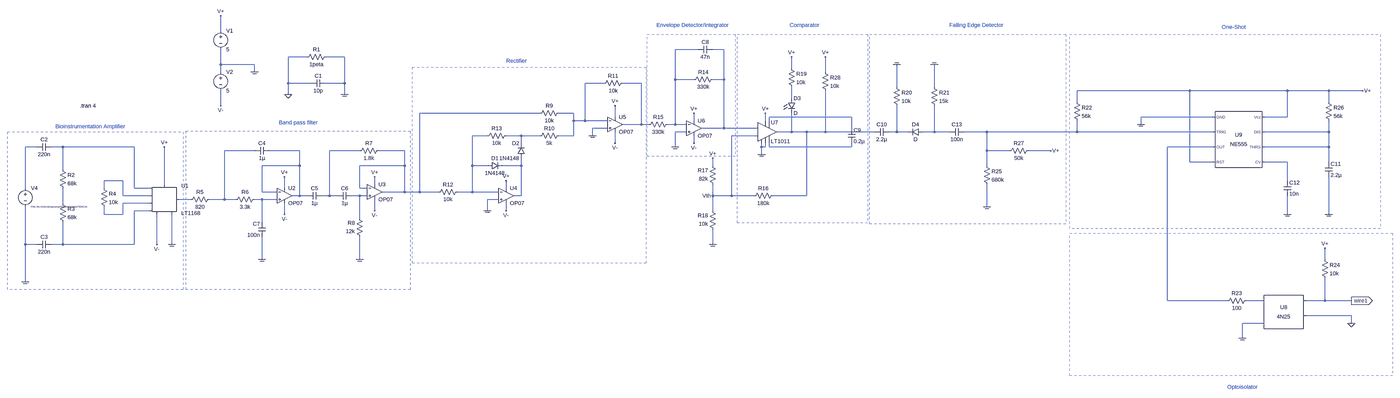
[diagram p0: schematic Full_EMG.asc, whole sheet]
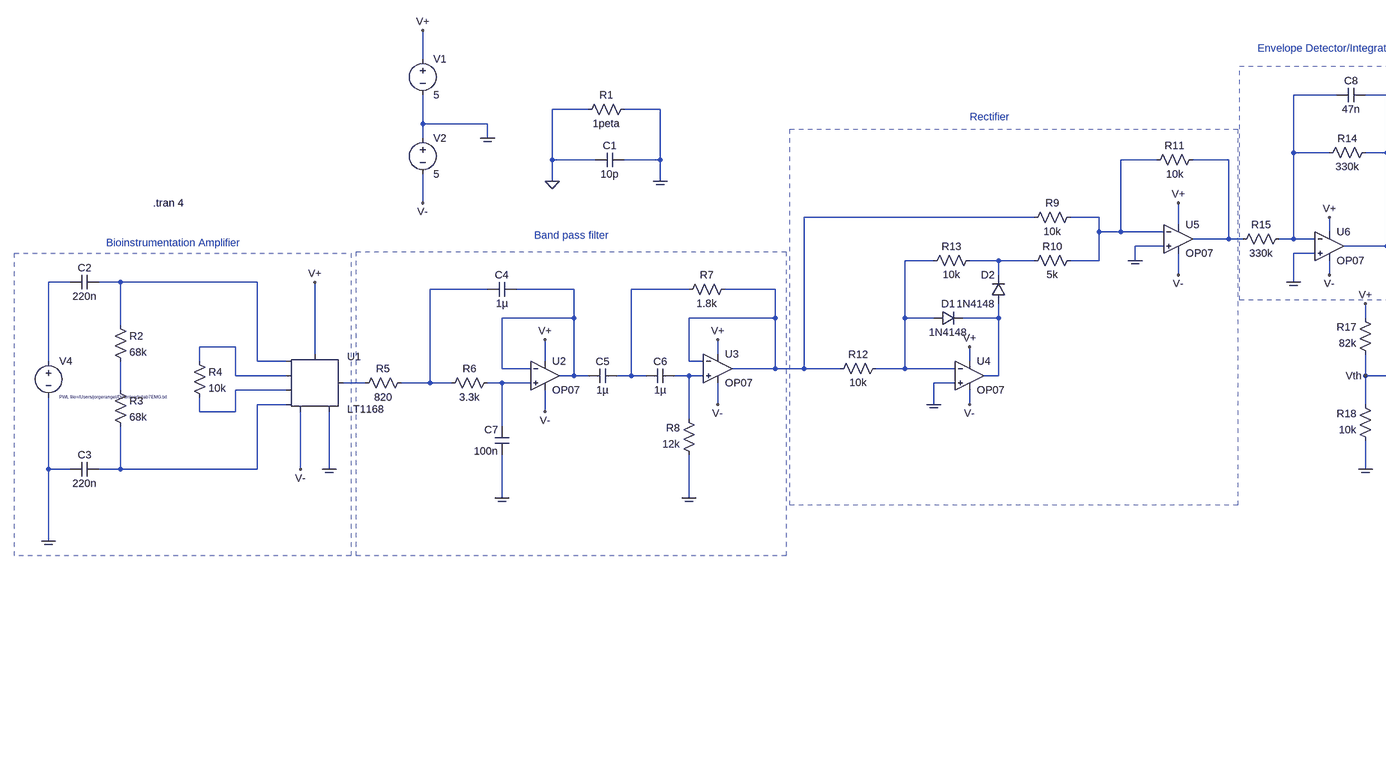
[diagram p1: schematic Full_EMG.asc, part, row 1 of 1, column 1 of 2]
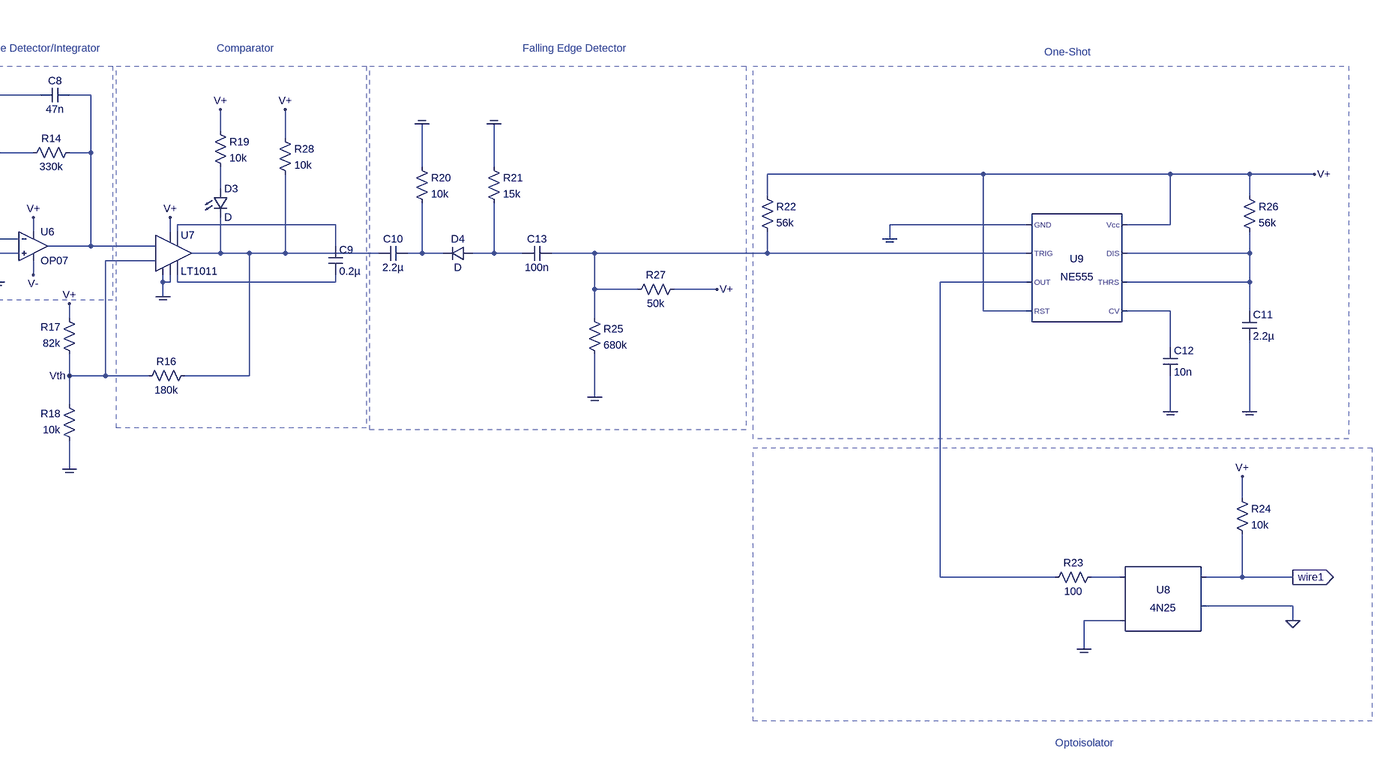
[diagram p2: schematic Full_EMG.asc, part, row 1 of 1, column 2 of 2]
Full_EMG.asc, the LTspice schematic file:
Version 4
SHEET 1 5388 960
WIRE 160 -576 160 -640
WIRE 2192 -496 2096 -496
WIRE 2304 -496 2256 -496
WIRE 528 -464 448 -464
WIRE 688 -464 608 -464
WIRE 160 -432 160 -496
WIRE 304 -432 160 -432
WIRE 2592 -416 2592 -464
WIRE 160 -400 160 -432
WIRE 304 -400 304 -432
WIRE 2736 -400 2736 -464
WIRE 2096 -368 2096 -496
WIRE 2176 -368 2096 -368
WIRE 2304 -368 2304 -496
WIRE 2304 -368 2256 -368
WIRE 448 -352 448 -464
WIRE 544 -352 448 -352
WIRE 688 -352 688 -464
WIRE 688 -352 608 -352
WIRE 1792 -352 1712 -352
WIRE 1952 -352 1872 -352
WIRE 3040 -336 3040 -432
WIRE 3200 -336 3200 -432
WIRE 4288 -320 3808 -320
WIRE 4704 -320 4288 -320
WIRE 4880 -320 4704 -320
WIRE 5024 -320 4880 -320
WIRE 448 -304 448 -352
WIRE 688 -304 688 -352
WIRE 2592 -288 2592 -336
WIRE 3808 -272 3808 -320
WIRE 4880 -272 4880 -320
WIRE 160 -256 160 -320
WIRE 1520 -224 1008 -224
WIRE 1664 -224 1600 -224
WIRE 1840 -208 1840 -256
WIRE 2848 -208 2496 -208
WIRE 4384 -208 4080 -208
WIRE 4704 -208 4704 -320
WIRE 4704 -208 4608 -208
WIRE 1664 -192 1664 -224
WIRE 1712 -192 1712 -352
WIRE 1712 -192 1664 -192
WIRE 1808 -192 1712 -192
WIRE 2176 -192 2176 -224
WIRE 2480 -192 2480 -224
WIRE 2496 -192 2496 -208
WIRE 1952 -176 1952 -352
WIRE 1952 -176 1872 -176
WIRE 1984 -176 1952 -176
WIRE 2096 -176 2096 -368
WIRE 2096 -176 2064 -176
WIRE 2144 -176 2096 -176
WIRE 4080 -176 4080 -208
WIRE 1808 -160 1744 -160
WIRE 2304 -160 2304 -368
WIRE 2304 -160 2208 -160
WIRE 2448 -160 2304 -160
WIRE 2848 -160 2848 -208
WIRE 2144 -144 2096 -144
WIRE 2592 -144 2592 -224
WIRE 2592 -144 2528 -144
WIRE 2656 -144 2592 -144
WIRE 2736 -144 2736 -320
WIRE 2736 -144 2656 -144
WIRE 2944 -144 2736 -144
WIRE 3040 -144 3040 -256
WIRE 3040 -144 3008 -144
WIRE 3088 -144 3040 -144
WIRE 3200 -144 3200 -256
WIRE 3200 -144 3152 -144
WIRE 3264 -144 3200 -144
WIRE 3424 -144 3328 -144
WIRE 3808 -144 3808 -192
WIRE 3808 -144 3424 -144
WIRE 4384 -144 3808 -144
WIRE 4880 -144 4880 -192
WIRE 4880 -144 4608 -144
WIRE 1296 -128 1232 -128
WIRE 1440 -128 1376 -128
WIRE 1520 -128 1440 -128
WIRE 1664 -128 1664 -192
WIRE 1664 -128 1600 -128
WIRE 1744 -128 1744 -160
WIRE 2448 -128 2336 -128
WIRE 1440 -96 1440 -128
WIRE 1840 -96 1840 -144
WIRE 2176 -96 2176 -128
WIRE -624 -80 -672 -80
WIRE -512 -80 -560 -80
WIRE -208 -80 -512 -80
WIRE 2096 -80 2096 -144
WIRE 2464 -80 2464 -96
WIRE 2480 -80 2480 -96
WIRE 2480 -80 2464 -80
WIRE 2496 -80 2496 -96
WIRE 2848 -80 2848 -96
WIRE 2848 -80 2496 -80
WIRE 4384 -80 4192 -80
WIRE 4880 -80 4880 -144
WIRE 4880 -80 4608 -80
WIRE 304 -64 176 -64
WIRE 496 -64 368 -64
WIRE 752 -64 624 -64
WIRE 944 -64 832 -64
WIRE 3424 -64 3424 -144
WIRE 3520 -64 3424 -64
WIRE 3696 -64 3600 -64
WIRE 2464 -48 2464 -80
WIRE 4288 -16 4288 -320
WIRE 4384 -16 4288 -16
WIRE 4704 -16 4608 -16
WIRE 4880 -16 4880 -80
WIRE 496 0 496 -64
WIRE 496 0 336 0
WIRE 944 0 944 -64
WIRE 944 0 752 0
WIRE 1232 0 1232 -128
WIRE 1296 0 1232 0
WIRE 1440 0 1440 -32
WIRE 1440 0 1360 0
WIRE 2256 0 2256 -32
WIRE 3424 0 3424 -64
WIRE -512 16 -512 -80
WIRE -256 64 -336 64
WIRE 4704 64 4704 -16
WIRE -80 80 -80 -80
WIRE 816 80 816 48
WIRE -672 96 -672 -80
WIRE -336 96 -336 64
WIRE -208 96 -208 -80
WIRE -144 96 -208 96
WIRE 432 96 432 48
WIRE 752 96 752 0
WIRE 784 96 752 96
WIRE 1376 96 1376 64
WIRE 336 112 336 0
WIRE 400 112 336 112
WIRE 944 112 944 0
WIRE 944 112 848 112
WIRE 1008 112 1008 -224
WIRE 1008 112 944 112
WIRE 1088 112 1008 112
WIRE 1232 112 1232 0
WIRE 1232 112 1168 112
WIRE 1344 112 1232 112
WIRE -256 128 -256 64
WIRE -144 128 -256 128
WIRE 496 128 496 0
WIRE 496 128 464 128
WIRE 528 128 496 128
WIRE 624 128 624 -64
WIRE 624 128 592 128
WIRE 656 128 624 128
WIRE 752 128 720 128
WIRE 784 128 752 128
WIRE 1440 128 1440 0
WIRE 1440 128 1408 128
WIRE 2256 128 2256 80
WIRE 2336 128 2336 -128
WIRE 2336 128 2256 128
WIRE 2432 128 2336 128
WIRE 2656 128 2656 -144
WIRE 2656 128 2512 128
WIRE 32 144 -16 144
WIRE 176 144 176 -64
WIRE 176 144 112 144
WIRE 224 144 176 144
WIRE 336 144 304 144
WIRE 400 144 336 144
WIRE 1344 144 1296 144
WIRE -512 160 -512 96
WIRE -144 160 -256 160
WIRE 3424 176 3424 80
WIRE -144 192 -208 192
WIRE 816 192 816 144
WIRE 1296 192 1296 144
WIRE 1376 192 1376 160
WIRE 2256 192 2256 128
WIRE -336 208 -336 176
WIRE -256 208 -256 160
WIRE -256 208 -336 208
WIRE 432 208 432 160
WIRE 4704 208 4704 128
WIRE 4880 208 4880 48
WIRE 752 224 752 128
WIRE 336 240 336 144
WIRE -672 336 -672 176
WIRE -624 336 -672 336
WIRE -512 336 -512 240
WIRE -512 336 -560 336
WIRE -208 336 -208 192
WIRE -208 336 -512 336
WIRE -112 336 -112 208
WIRE -48 336 -48 208
WIRE 2256 336 2256 272
WIRE 336 400 336 304
WIRE 752 400 752 304
WIRE 4864 400 4864 352
WIRE -672 496 -672 336
WIRE 4192 576 4192 -80
WIRE 4448 576 4192 576
WIRE 4592 576 4528 576
WIRE 4864 576 4864 480
WIRE 4864 576 4784 576
WIRE 4976 576 4864 576
WIRE 4976 640 4784 640
WIRE 4592 672 4512 672
WIRE 4976 672 4976 640
WIRE 4512 736 4512 672
FLAG 304 -400 COM
FLAG 160 -640 V+
FLAG 160 -256 V-
FLAG 448 -304 0
FLAG 688 -304 COM
FLAG -48 336 COM
FLAG -672 496 COM
FLAG -80 -80 V+
FLAG -112 336 V-
FLAG 336 400 COM
FLAG 752 400 COM
FLAG 816 48 V+
FLAG 816 192 V-
FLAG 432 208 V-
FLAG 432 48 V+
FLAG 1840 -256 V+
FLAG 1840 -96 V-
FLAG 1376 192 V-
FLAG 1376 64 V+
FLAG 1296 192 COM
FLAG 1744 -128 COM
FLAG 2176 -224 V+
FLAG 2176 -96 V-
FLAG 2096 -80 COM
FLAG 2256 336 COM
FLAG 2256 -32 V+
FLAG 2464 -48 COM
FLAG 2480 -224 V+
FLAG 2256 128 Vth
FLAG 2592 -464 V+
FLAG 3200 -432 COM
FLAG 3040 -432 COM
FLAG 4976 672 0
FLAG 4512 736 COM
FLAG 4864 352 V+
FLAG 4976 576 wire1
IOPIN 4976 576 Out
FLAG 4704 208 COM
FLAG 4880 208 COM
FLAG 4080 -176 COM
FLAG 5024 -320 V+
FLAG 3424 176 COM
FLAG 3696 -64 V+
FLAG 2736 -464 V+
SYMBOL Voltage 160 -592 R0
SYMATTR InstName V1
SYMATTR Value 5
SYMBOL Voltage 160 -416 R0
SYMATTR InstName V2
SYMATTR Value 5
SYMBOL Res 624 -480 R90
WINDOW 0 0 56 VBottom 2
WINDOW 3 32 56 VTop 2
SYMATTR InstName R1
SYMATTR Value 1peta
SYMBOL Cap 608 -368 R90
WINDOW 0 0 32 VBottom 2
WINDOW 3 32 32 VTop 2
SYMATTR InstName C1
SYMATTR Value 10p
SYMBOL Voltage -672 80 R0
WINDOW 3 24 96 Left 0
SYMATTR Value PWL file=/Users/jorgerangel/Downloads/lab7EMG.txt
SYMATTR InstName V4
SYMBOL Cap -560 -96 R90
WINDOW 0 0 32 VBottom 2
WINDOW 3 32 32 VTop 2
SYMATTR InstName C2
SYMATTR Value 220n
SYMBOL Cap -560 320 R90
WINDOW 0 0 32 VBottom 2
WINDOW 3 32 32 VTop 2
SYMATTR InstName C3
SYMATTR Value 220n
SYMBOL Res -528 0 R0
SYMATTR InstName R2
SYMATTR Value 68k
SYMBOL Res -528 144 R0
SYMATTR InstName R3
SYMATTR Value 68k
SYMBOL Res -352 80 R0
SYMATTR InstName R4
SYMATTR Value 10k
SYMBOL OpAmps/LT1168 -80 144 R0
SYMATTR InstName U1
SYMBOL Res 128 128 R90
WINDOW 0 0 56 VBottom 2
WINDOW 3 32 56 VTop 2
SYMATTR InstName R5
SYMATTR Value 820
SYMBOL Res 320 128 R90
WINDOW 0 0 56 VBottom 2
WINDOW 3 32 56 VTop 2
SYMATTR InstName R6
SYMATTR Value 3.3k
SYMBOL Res 848 -80 R90
WINDOW 0 0 56 VBottom 2
WINDOW 3 32 56 VTop 2
SYMATTR InstName R7
SYMATTR Value 1.8k
SYMBOL Res 768 320 R180
WINDOW 0 36 76 Left 2
WINDOW 3 36 40 Left 2
SYMATTR InstName R8
SYMATTR Value 12k
SYMBOL OpAmps/OP07 432 64 R0
SYMATTR InstName U2
SYMBOL Cap 368 -80 R90
WINDOW 0 0 32 VBottom 2
WINDOW 3 32 32 VTop 2
SYMATTR InstName C4
SYMATTR Value 1µ
SYMBOL Cap 592 112 R90
WINDOW 0 0 32 VBottom 2
WINDOW 3 32 32 VTop 2
SYMATTR InstName C5
SYMATTR Value 1µ
SYMBOL Cap 720 112 R90
WINDOW 0 0 32 VBottom 2
WINDOW 3 32 32 VTop 2
SYMATTR InstName C6
SYMATTR Value 1µ
SYMBOL Cap 352 304 R180
WINDOW 0 24 56 Left 2
WINDOW 3 24 8 Left 2
SYMATTR InstName C7
SYMATTR Value 100n
SYMBOL OpAmps/OP07 816 48 R0
SYMATTR InstName U3
SYMBOL Res 1616 -240 R90
WINDOW 0 0 56 VBottom 2
WINDOW 3 32 56 VTop 2
SYMATTR InstName R9
SYMATTR Value 10k
SYMBOL Res 1616 -144 R90
WINDOW 0 0 56 VBottom 2
WINDOW 3 32 56 VTop 2
SYMATTR InstName R10
SYMATTR Value 5k
SYMBOL Res 1888 -368 R90
WINDOW 0 0 56 VBottom 2
WINDOW 3 32 56 VTop 2
SYMATTR InstName R11
SYMATTR Value 10k
SYMBOL OpAmps/OP07 1376 64 R0
SYMATTR InstName U4
SYMBOL OpAmps/OP07 1840 -240 R0
SYMATTR InstName U5
SYMBOL Res 1184 96 R90
WINDOW 0 0 56 VBottom 2
WINDOW 3 32 56 VTop 2
SYMATTR InstName R12
SYMATTR Value 10k
SYMBOL Diode 1296 16 R270
WINDOW 0 32 32 VTop 2
WINDOW 3 0 32 VBottom 2
SYMATTR InstName D1
SYMATTR Value 1N4148
SYMBOL Diode 1456 -32 R180
WINDOW 0 24 64 Left 2
WINDOW 3 24 0 Left 2
SYMATTR InstName D2
SYMATTR Value 1N4148
SYMBOL Res 1392 -144 R90
WINDOW 0 0 56 VBottom 2
WINDOW 3 32 56 VTop 2
SYMATTR InstName R13
SYMATTR Value 10k
SYMBOL Res 2160 -352 R270
WINDOW 0 32 56 VTop 2
WINDOW 3 0 56 VBottom 2
SYMATTR InstName R14
SYMATTR Value 330k
SYMBOL Cap 2192 -480 R270
WINDOW 0 32 32 VTop 2
WINDOW 3 0 32 VBottom 2
SYMATTR InstName C8
SYMATTR Value 47n
SYMBOL Res 1968 -160 R270
WINDOW 0 32 56 VTop 2
WINDOW 3 0 56 VBottom 2
SYMATTR InstName R15
SYMATTR Value 330k
SYMBOL OpAmps/OP07 2176 -224 R0
SYMATTR InstName U6
SYMBOL Res 2528 112 R90
WINDOW 0 0 56 VBottom 2
WINDOW 3 32 56 VTop 2
SYMATTR InstName R16
SYMATTR Value 180k
SYMBOL Res 2272 96 R180
WINDOW 0 36 76 Left 2
WINDOW 3 36 40 Left 2
SYMATTR InstName R17
SYMATTR Value 82k
SYMBOL Res 2272 288 R180
WINDOW 0 36 76 Left 2
WINDOW 3 36 40 Left 2
SYMATTR InstName R18
SYMATTR Value 10k
SYMBOL Comparators/LT1011 2480 -144 R0
SYMATTR InstName U7
SYMBOL Res 2576 -432 R0
SYMATTR InstName R19
SYMATTR Value 10k
SYMBOL LED 2576 -288 R0
SYMATTR InstName D3
SYMBOL Cap 2832 -160 R0
SYMATTR InstName C9
SYMATTR Value 0.2µ
SYMBOL Diode 3152 -160 R90
WINDOW 0 0 32 VBottom 2
WINDOW 3 32 32 VTop 2
SYMATTR InstName D4
SYMBOL Cap 3008 -160 R90
WINDOW 0 0 32 VBottom 2
WINDOW 3 32 32 VTop 2
SYMATTR InstName C10
SYMATTR Value 2.2µ
SYMBOL Res 3024 -352 R0
SYMATTR InstName R20
SYMATTR Value 10k
SYMBOL Res 3184 -352 R0
SYMATTR InstName R21
SYMATTR Value 15k
SYMBOL Optos/4N25 4688 640 R0
SYMATTR InstName U8
SYMBOL Res 4544 560 R90
WINDOW 0 0 56 VBottom 2
WINDOW 3 32 56 VTop 2
SYMATTR InstName R23
SYMATTR Value 100
SYMBOL Res 4848 384 R0
SYMATTR InstName R24
SYMATTR Value 10k
SYMBOL Misc/NE555 4496 -112 R0
SYMATTR InstName U9
SYMBOL Res 3792 -288 R0
SYMATTR InstName R22
SYMATTR Value 56k
SYMBOL Res 4864 -288 R0
SYMATTR InstName R26
SYMATTR Value 56k
SYMBOL Cap 4864 -16 R0
SYMATTR InstName C11
SYMATTR Value 2.2µ
SYMBOL Cap 4688 64 R0
SYMATTR InstName C12
SYMATTR Value 10n
SYMBOL Cap 3328 -160 R90
WINDOW 0 0 32 VBottom 2
WINDOW 3 32 32 VTop 2
SYMATTR InstName C13
SYMATTR Value 100n
SYMBOL Res 3408 -16 R0
SYMATTR InstName R25
SYMATTR Value 680k
SYMBOL Res 3616 -80 R90
WINDOW 0 0 56 VBottom 2
WINDOW 3 32 56 VTop 2
SYMATTR InstName R27
SYMATTR Value 50k
SYMBOL Res 2720 -416 R0
SYMATTR InstName R28
SYMATTR Value 10k
TEXT -440 -256 Left 2 !.tran 4
TEXT -544 -168 Left 2 ;Bioinstrumentation Amplifier
TEXT 408 -184 Left 2 ;Band pass filter
TEXT 1376 -448 Left 2 ;Rectifier
TEXT 2016 -600 Left 2 ;Envelope Detector/Integrator
TEXT 2584 -600 Left 2 ;Comparator
TEXT 3264 -600 Left 2 ;Falling Edge Detector
TEXT 4424 -592 Left 2 ;One-Shot
TEXT 4448 944 Left 2 ;Optoisolator
RECTANGLE Normal -748 -144 0 528 2
RECTANGLE Normal 12 -148 968 528 2
RECTANGLE Normal 976 -420 1972 416 2
RECTANGLE Normal 1976 -560 2352 -40 2
RECTANGLE Normal 2360 -560 2916 244 2
RECTANGLE Normal 2924 -560 3760 248 2
RECTANGLE Normal 3776 -560 5100 268 2
RECTANGLE Normal 3776 288 5152 896 2

The netlist it stands for:
* Full_EMG.asc
V1 V+ COM 5
V2 COM V- 5
R1 COM 0 1peta
C1 COM 0 10p
V4 N015 COM PWL file=/Users/jorgerangel/Downloads/lab7EMG.txt
C2 N016 N015 220n
C3 N030 COM 220n
R2 N016 N028 68k
R3 N028 N030 68k
R4 N024 N029 10k
XU1 N024 N030 N016 V- COM N026 V+ N029 LT1168
R5 N019 N026 820
R6 N027 N019 3.3k
R7 N006 N021 1.8k
R8 COM N025 12k
XU2 N027 N020 V+ V- N020 LT1001  ; OP07, pins In+ In- V+ V- OUT
C4 N020 N019 1µ
C5 N021 N020 1µ
C6 N025 N021 1µ
C7 COM N027 100n
XU3 N025 N006 V+ V- N006 LT1001  ; OP07, pins In+ In- V+ V- OUT
R9 N003 N006 10k
R10 N003 N014 5k
R11 N004 N003 10k
XU4 COM N013 V+ V- N023 LT1001  ; OP07, pins In+ In- V+ V- OUT
XU5 COM N003 V+ V- N004 LT1001  ; OP07, pins In+ In- V+ V- OUT
R12 N013 N006 10k
D1 N013 N023 1N4148
D2 N023 N014 1N4148
R13 N014 N013 10k
R14 N001 N002 330k
C8 N001 N002 47n
R15 N004 N001 330k
XU6 COM N001 V+ V- N002 LT1001  ; OP07, pins In+ In- V+ V- OUT
R16 N008 Vth 180k
R17 Vth V+ 82k
R18 COM Vth 10k
XU7 COM Vth N002 COM N007 N017 N008 V+ LT1011
R19 V+ N005 10k
D3 N005 N008 D
C9 N007 N017 0.2µ
D4 N010 N009 D
C10 N009 N008 2.2µ
R20 COM N009 10k
R21 COM N010 15k
XU8 N031 COM wire1 0 NC_01 4N25
R23 N031 N018 100
R24 V+ wire1 10k
XU9 COM N011 N018 V+ N022 N012 N012 V+ NE555  ; pins GND TRIG OUT RST CV THRS DIS Vcc
R22 V+ N011 56k
R26 V+ N012 56k
C11 N012 COM 2.2µ
C12 N022 COM 10n
C13 N011 N010 100n
R25 N011 COM 680k
R27 V+ N011 50k
R28 V+ N008 10k
.model D D
.lib standard.dio
.tran 4
* Bioinstrumentation Amplifier
* Band pass filter
* Rectifier
* Envelope Detector/Integrator
* Comparator
* Falling Edge Detector
* One-Shot
* Optoisolator
.lib LTC.lib
.lib LTC1.lib
.lib 4N25.sub
.lib NE555.sub
.backanno
.end